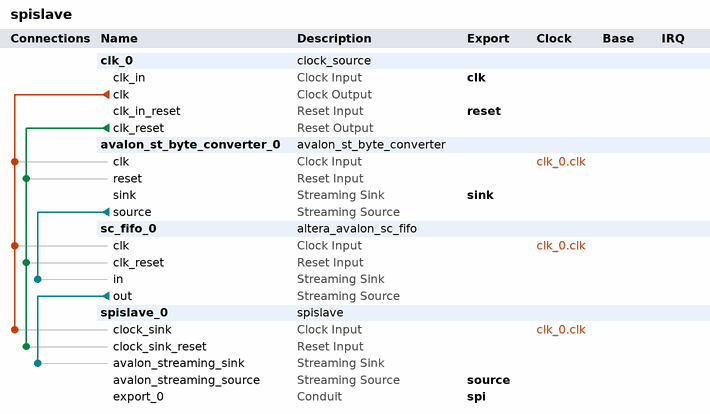
[diagram p0: system contents]
# Platform Designer (Qsys) system spislave, Cyclone 10 LP 10CL025YU256C8G
# Parameters at their usual value, and those the tool derives, are not listed.
package require -exact qsys 20.1
create_system spislave
set_project_property DEVICE_FAMILY {Cyclone 10 LP}
set_project_property DEVICE 10CL025YU256C8G

add_instance clk_0 clock_source 20.1
set_instance_parameter_value clk_0 clockFrequency 50000000

add_instance avalon_st_byte_converter_0 avalon_st_byte_converter 1.0
set_instance_parameter_value avalon_st_byte_converter_0 CHANNEL_WIDTH 8
set_instance_parameter_value avalon_st_byte_converter_0 SINK_SYMBOLS 2
set_instance_parameter_value avalon_st_byte_converter_0 SYMBOL_WIDTH 8

add_instance sc_fifo_0 altera_avalon_sc_fifo 20.1
set_instance_parameter_value sc_fifo_0 BITS_PER_SYMBOL 8
set_instance_parameter_value sc_fifo_0 CHANNEL_WIDTH 0
set_instance_parameter_value sc_fifo_0 ERROR_WIDTH 0
set_instance_parameter_value sc_fifo_0 FIFO_DEPTH 1024
set_instance_parameter_value sc_fifo_0 USE_FILL_LEVEL 0
set_instance_parameter_value sc_fifo_0 USE_MEMORY_BLOCKS 1
set_instance_parameter_value sc_fifo_0 USE_STORE_FORWARD 0

add_instance spislave_0 spislave 20.1
set_instance_parameter_value spislave_0 SYNC_DEPTH 2

# connections
add_connection clk_0.clk avalon_st_byte_converter_0.clk clock
add_connection clk_0.clk sc_fifo_0.clk clock
add_connection clk_0.clk spislave_0.clock_sink clock
add_connection clk_0.clk_reset avalon_st_byte_converter_0.reset reset
add_connection clk_0.clk_reset sc_fifo_0.clk_reset reset
add_connection clk_0.clk_reset spislave_0.clock_sink_reset reset
add_connection avalon_st_byte_converter_0.source sc_fifo_0.in avalon_streaming
add_connection sc_fifo_0.out spislave_0.avalon_streaming_sink avalon_streaming

# exported interfaces
add_interface clk clock sink
set_interface_property clk EXPORT_OF clk_0.clk_in
add_interface reset reset sink
set_interface_property reset EXPORT_OF clk_0.clk_in_reset
add_interface sink avalon_streaming sink
set_interface_property sink EXPORT_OF avalon_st_byte_converter_0.sink
add_interface source avalon_streaming source
set_interface_property source EXPORT_OF spislave_0.avalon_streaming_source
add_interface spi conduit end
set_interface_property spi EXPORT_OF spislave_0.export_0

set_interconnect_requirement {$system} qsys_mm.clockCrossingAdapter HANDSHAKE
set_interconnect_requirement {$system} qsys_mm.enableEccProtection FALSE
set_interconnect_requirement {$system} qsys_mm.insertDefaultSlave FALSE
set_interconnect_requirement {$system} qsys_mm.maxAdditionalLatency 1

save_system spislave.qsys
